# Altium schematic sheet PowerChargingBoard_2025-02-05.schdoc
size 403 x 219 mm
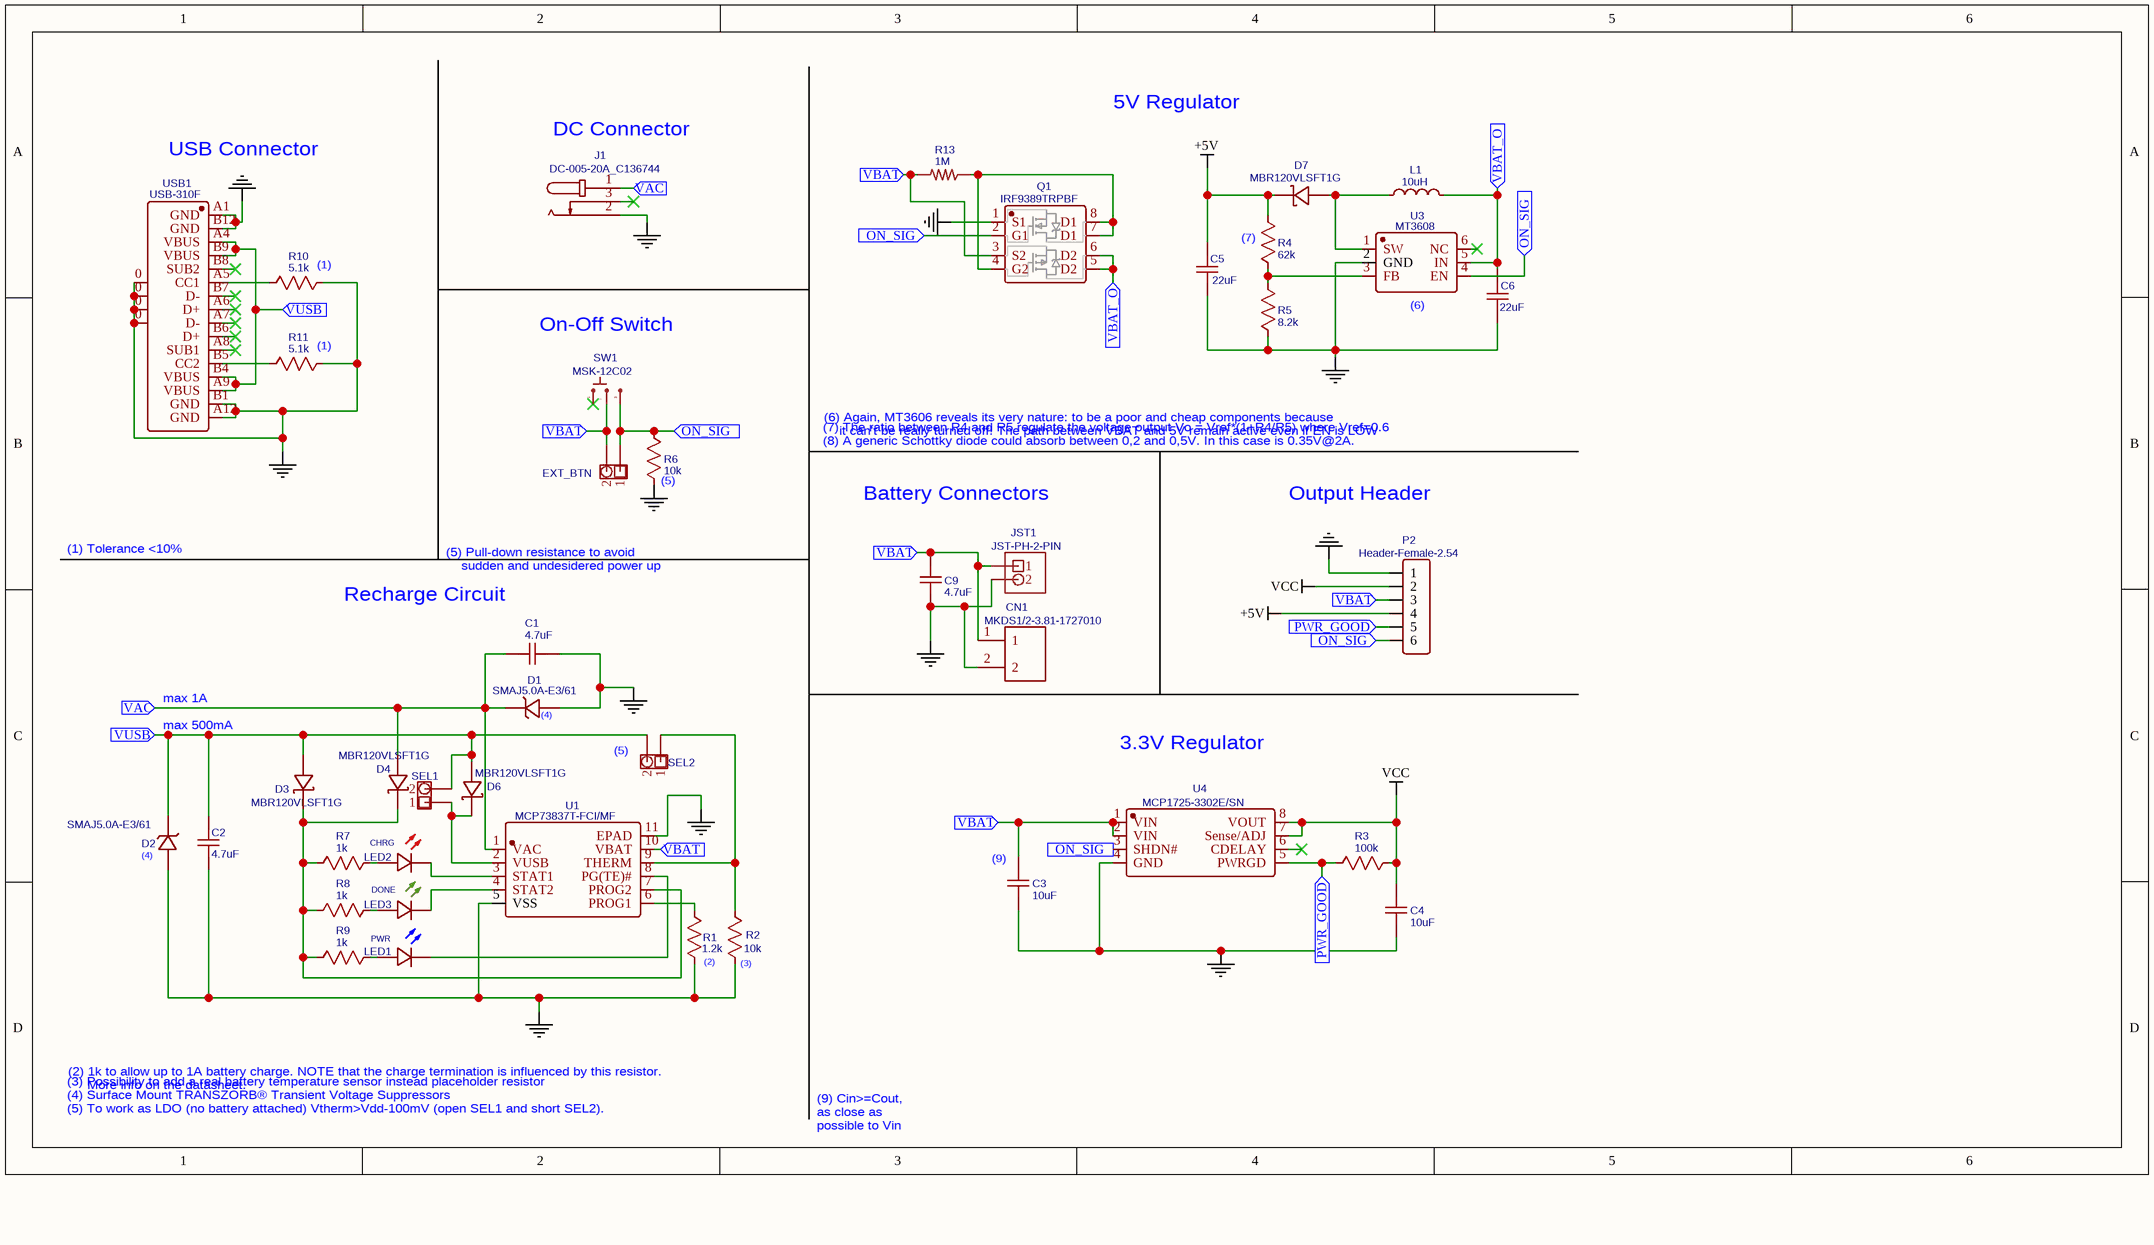
[diagram p0: PowerChargingBoard_2025-02-05.schdoc]

## Parts
C1  4.7uF  [C0603]
C2  4.7uF  [C0603]
C3  10uF  [C0603]
C4  10uF  [C0603]
C5  22uF  [C0603]
C6  22uF  [C0603]
C9  4.7uF  [C0603]
CN1  MKDS1/2-3.81-1727010  [CONN-TH_2P-P3.81_1727010]
D1  SMAJ5.0A-E3/61  [SMA_L4.3-W2.6-LS5.2-RD]
D2  SMAJ5.0A-E3/61  [SMA_L4.3-W2.6-LS5.2-RD]
D3  MBR120VLSFT1G  [SOD-123F_L2.8-W1.8-LS3.7-RD]
D4  MBR120VLSFT1G  [SOD-123F_L2.8-W1.8-LS3.7-RD]
D6  MBR120VLSFT1G  [SOD-123F_L2.8-W1.8-LS3.7-RD]
D7  MBR120VLSFT1G  [SOD-123F_L2.8-W1.8-LS3.7-RD]
EXT_BTN  Just a couple of 2.54-spaced pins  [1X02 2.54MM HOLES HEADERS PINS]  (value not drawn)
J1  DC-005-20A_C136744  [DC-IN-TH_DC-005-20A]
JST1  JST-PH-2-PIN  [JST-PH-2-SMT-RA]
L1  10uH  [L2020]
LED1  PWR  [0603-LED]
LED2  CHRG  [0603-LED]
LED3  DONE  [0603-LED]
P2  Header-Female-2.54  [HDR-6X1/2.54]
Q1  IRF9389TRPBF  [SOIC-8_L4.9-W3.9-P1.27-LS6.0-BL]
R1  1.2k  [R0603]
R2  10k  [R0603]
R3  100k  [R0603]
R4  62k  [R0603]
R5  8.2k  [R0603]
R6  10k  [R0603]
R7  1k  [R0603]
R8  1k  [R0603]
R9  1k  [R0603]
R10  5.1k  [R0603]
R11  5.1k  [R0603]
R13  1M  [R0603]
SEL1  Just a couple of 2.54-spaced pins  [1X02 2.54MM HOLES HEADERS PINS]  (value not drawn)
SEL2  Just a couple of 2.54-spaced pins  [1X02 2.54MM HOLES HEADERS PINS]  (value not drawn)
SW1  MSK-12C02  [SW-TH_MSK12C02]
U1  MCP73837T-FCI/MF  [DFN-MF10]
U3  MT3608  [SOT-23-6_L2.9-W1.6-P0.95-LS2.8-BR]
U4  MCP1725-3302E/SN  [SOIC-8_L4.9-W3.9-P1.27-LS6.0-BL]
USB1  USB-310F  [USB-C-SMD_20P-P0.50-L6.5-W8.9]

## Ports
ON_SIG (in), PWR_GOOD (in), VAC (in), VBAT (in), VBAT_O (in), VUSB (in)

## Nets
+5V: C5.2 D7.1(K) P2.4 R4.2
GND: C1.1 C2.1 C3.1 C4.1 C5.1 C6.1 C9.1 CN1.2 D1.2(A) D2.2(A) J1.2 JST1.2 P2.1 Q1.1(S1) R1.1 R2.1 R5.1 R6.1 R10.2 R11.2 U1.5(VSS) U1.11(EPAD) U3.2(GND) U4.4(GND) USB1.0 USB1.A1(GND) USB1.A12(GND) USB1.B1(GND) USB1.B12(GND)
VCC: C4.2 P2.2 R3.2 U4.7(Sense/ADJ) U4.8(VOUT)
ON_SIG: EXT_BTN.1 P2.6 Q1.2(G1) R6.2 SW1.3 U3.4(EN) U4.3(SHDN#) ; port ON_SIG
PWR_GOOD: P2.5 R3.1 U4.5(PWRGD) ; port PWR_GOOD
VAC: C1.2 D1.1(C) D4.2(A) J1.1 U1.1(VAC) ; port VAC
VBAT: C3.2 C9.2 CN1.1 EXT_BTN.2 JST1.1 P2.3 Q1.3(S2) R13.2 SW1.2 U1.10(VBAT) U4.1(VIN) U4.2(VIN) ; port VBAT
VBAT_O: C6.2 L1.2 Q1.5(D2) Q1.6(D2) U3.5(IN) ; port VBAT_O
VUSB: C2.2 D2.1(C) D3.2(A) D6.2(A) SEL1.2 SEL2.2 USB1.A4(VBUS) USB1.A9(VBUS) USB1.B4(VBUS) USB1.B9(VBUS) ; port VUSB
NetD3_1: D3.1(K) D4.1(K) R7.1 R8.1 R9.1 U1.7(PROG2)
NetD6_1: D6.1(K) SEL1.1 U1.2(VUSB)
NetD7_2: D7.2(A) L1.1 U3.1(SW)
NetLED1_1: LED1.1(+) R9.2
NetLED1_2: LED1.2(-) U1.8(PG(TE)#)
NetLED2_1: LED2.1(+) R7.2
NetLED2_2: LED2.2(-) U1.3(STAT1)
NetLED3_1: LED3.1(+) R8.2
NetLED3_2: LED3.2(-) U1.4(STAT2)
NetQ1_4: Q1.4(G2) Q1.7(D1) Q1.8(D1) R13.1
NetR1_2: R1.2 U1.6(PROG1)
NetR2_2: R2.2 SEL2.1 U1.9(THERM)
NetR4_1: R4.1 R5.2 U3.3(FB)
NetR10_1: R10.1 USB1.A5(CC1)
NetR11_1: R11.1 USB1.B5(CC2)

Not connected (* = marked no-connect by the designer): J1 3*; SW1 1*; U3 6(NC)*; U4 6(CDELAY)*; USB1 A6(D+)* A7(D-)* A8(SUB1)* B6(D+)* B7(D-)* B8(SUB2)*

## Notes on the sheet
- 5V Regulator
- USB Connector
- (near J1) DC Connector
- (near R4) (7)
- (near R10) (1)
- (near U3) (6)
- (near R11) (1)
- On-Off Switch
- (8) A generic Schottky diode could absorb between 0,2 and 0,5V. In this case is 0.35V@2A.
- (near C9) (6) Again, MT3606 reveals its very nature: to be a poor and cheap components because
  it can't be really turned off! The path between VBAT and 5V remain active even if EN is LOW
- (7) The ratio between R4 and R5 regulate the voltage output Vo = Vref*(1+R4/R5) where Vref=0.6
- (near R6) (5)
- Battery Connectors
- Output Header
- (1) Tolerance <10%
- (near C1) (5) Pull-down resistance to avoid
  sudden and undesidered power up
- (near C1) Recharge Circuit
- max 1A
- max 500mA
- (near D1) (4)
- (near SEL2) (5)
- 3.3V Regulator
- (near D2) (4)
- (near C3) (9)
- (near R1) (2)
- (near R2) (3)
- (2) 1k to allow up to 1A battery charge. NOTE that the charge termination is influenced by this resistor.
  More info on the datasheet.
- (4) Surface Mount TRANSZORB® Transient Voltage Suppressors
- (5) To work as LDO (no battery attached) Vtherm>Vdd-100mV (open SEL1 and short SEL2).
- (3) Possibility to add a real battery temperature sensor instead placeholder resistor
- (9) Cin>=Cout,
  as close as
  possible to Vin

## Library data of the parts
C1 C2 C9 = 4.7uF: nameAlias: Value(F); Manufacturer Part: ?; spicePre: C; spiceSymbolName: Cap_RAD-0.1_US
C3 C4 = 10uF: nameAlias: Value(F); Manufacturer Part: ?; spicePre: C; spiceSymbolName: Cap_RAD-0.1_US
C5 C6 = 22uF: nameAlias: Value(F); Manufacturer Part: ?; spicePre: C; spiceSymbolName: Cap_RAD-0.1_US
CN1 = MKDS1/2-3.81-1727010: Manufacturer: Phoenix Contact; SMT Type: Extend; Supplier: LCSC; Manufacturer Part: MKDS1/2-3.81-1727010; Supplier Part: C89123; LCSC Assembly: Yes; spicePre: C; spiceSymbolName: MKDS1/2-3.81-1727010
D1 D2 = SMAJ5.0A-E3/61: Manufacturer: VISHAY; SMT Type: Extend; Supplier: LCSC; Manufacturer Part: SMAJ5.0A-E3/61; Supplier Part: C89363; JLCPCB SMD: Yes; LCSC Assembly: Yes; spicePre: D; spiceSymbolName: SMAJ5.0A-E3/61
D3 D4 D6 D7 = MBR120VLSFT1G: Manufacturer: ON Semicon; Contributor: LCSC; SMT Type: Extend; Supplier: LCSC; Supplier Part: C223608; Manufacturer Part: MBR120VLSFT1G; LCSC Assembly: Yes; spicePre: D; spiceSymbolName: MBR120VLSFT1G
EXT_BTN SEL1 SEL2 = Just a couple of 2.54-spaced pins: Contributor: fabiano.riccardi; Manufacturer Part: ?; spicePre: J
J1 = DC-005-20A_C136744: Manufacturer: HRO; Contributor: LCSC; SMT Type: Extend; Supplier: LCSC; Manufacturer Part: DC-005-20A; Supplier Part: C136744; LCSC Assembly: Yes; spicePre: D; spiceSymbolName: DC-005-20A_C136744
JST1 = JST-PH-2-PIN: Contributor: fabiano.riccardi; spicePre: J; spiceSymbolName: JST_2-PIN_Female_Connector
L1 = 10uH: Manufacturer: Murata Electronics; Manufacturer Part: LQH5BPN100M38L; nameAlias: Inductance; Contributor: LCSC; Supplier: LCSC; Supplier Part: C237555; spicePre: L; spiceSymbolName: LQH5BPN100M38L
LED1 = PWR: Manufacturer: Everlight Elec; Manufacturer Part: 17-21/BHC-XL2M2TY/3T; Supplier: LCSC; Supplier Part: C72035; spicePre: L
LED2 = CHRG: Manufacturer: Everlight Elec; Manufacturer Part: 17-21SURC/S530-A2/TR8; Supplier: LCSC; Supplier Part: C131244; spicePre: L
LED3 = DONE: Manufacturer: Foshan NationStar Optoelectronics; Manufacturer Part: FC-DA1608UGK-520D10; Contributor: EasyEDA; Supplier: LCSC; Supplier Part: C84267; spicePre: L
P2 = Header-Female-2.54: Manufacturer: BOOMELE; Manufacturer Part: Female header 1*6p; Supplier: LCSC; Supplier Part: C40877; spicePre: P
Q1 = IRF9389TRPBF: Manufacturer: Infineon; Contributor: LCSC; Supplier: LCSC; Manufacturer Part: IRF9389TRPBF; Supplier Part: C152654; spicePre: Q; spiceSymbolName: IRF9389TRPBF detailed
R1 = 1.2k: nameAlias: Value(Ω); Manufacturer Part: ?; spicePre: R; spiceSymbolName: Res_AXIAL-0.3(1/8W)_US
R2 R6 = 10k: nameAlias: Value(Ω); Manufacturer Part: ?; spicePre: R; spiceSymbolName: Res_AXIAL-0.3(1/8W)_US
R3 = 100k: nameAlias: Value(Ω); Manufacturer Part: ?; spicePre: R; spiceSymbolName: Res_AXIAL-0.3(1/8W)_US
R4 = 62k: nameAlias: Value(Ω); Manufacturer Part: ?; spicePre: R; spiceSymbolName: Res_AXIAL-0.3(1/8W)_US
R5 = 8.2k: nameAlias: Value(Ω); Manufacturer Part: ?; spicePre: R; spiceSymbolName: Res_AXIAL-0.3(1/8W)_US
R7-R9 = 1k: nameAlias: Value(Ω); Manufacturer Part: ?; spicePre: R; spiceSymbolName: Res_AXIAL-0.3(1/8W)_US
R10 R11 = 5.1k: nameAlias: Value(Ω); Manufacturer Part: ?; spicePre: R; spiceSymbolName: Res_AXIAL-0.3(1/8W)_US
SW1 = MSK-12C02: Manufacturer: SHOU HAN; Manufacturer Part: ?; spicePre: U; Supplier Part: C431540; Supplier: LCSC
U1 = MCP73837T-FCI/MF: Manufacturer: Microchip Tech; Contributor: LCSC; SMT Type: Extend; Paste Type: expand; Supplier: LCSC; Supplier Part: C623864; Manufacturer Part: MCP73837T-FCI/MF; JLCPCB SMD: Yes; LCSC Assembly: Yes; spicePre: U; spiceSymbolName: MCP73837T-FCI/MF
U3 = MT3608: Manufacturer: AEROSEMI; SMT Type: Extend; Supplier: LCSC; Manufacturer Part: MT3608; Supplier Part: C84817; JLCPCB SMD: Yes; spicePre: U; spiceSymbolName: MT3608
U4 = MCP1725-3302E/SN: Manufacturer: Microchip Tech; Contributor: fabiano.riccardi; SMT Type: Extend; Supplier: LCSC; Supplier Part: C185568; Manufacturer Part: MCP1725-3302E/SN; LCSC Assembly: Yes; spicePre: U; spiceSymbolName: MCP1725-3302E/SN
USB1 = USB-310F: Manufacturer: HOOYA; Contributor: LCSC; Supplier: LCSC; Supplier Part: C309365; Manufacturer Part: USB-310F; spicePre: U; spiceSymbolName: USB-310F